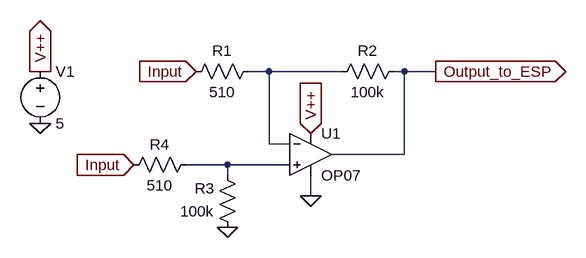
[diagram p0: schematic Amplifier.asc]
Amplifier.asc, the LTspice schematic file:
Version 4
SHEET 1 880 680
WIRE 352 112 320 112
WIRE 464 112 352 112
WIRE 560 112 544 112
WIRE 608 112 560 112
WIRE 352 224 352 112
WIRE 384 224 352 224
WIRE 560 240 560 112
WIRE 560 240 448 240
WIRE 288 256 224 256
WIRE 384 256 288 256
WIRE 288 272 288 256
WIRE 416 304 416 272
FLAG 0 112 V++
IOPIN 0 112 Out
FLAG 0 192 0
FLAG 416 208 V++
IOPIN 416 208 In
FLAG 608 112 Output_to_ESP
IOPIN 608 112 Out
FLAG 288 352 0
FLAG 144 256 Input
IOPIN 144 256 In
FLAG 240 112 Input
IOPIN 240 112 In
FLAG 416 304 0
SYMBOL voltage 0 96 R0
SYMATTR InstName V1
SYMATTR Value 5
SYMBOL OpAmps\\OP07 416 176 R0
SYMATTR InstName U1
SYMBOL res 336 96 R90
WINDOW 0 0 56 VBottom 2
WINDOW 3 32 56 VTop 2
SYMATTR InstName R1
SYMATTR Value 510
SYMBOL res 560 96 R90
WINDOW 0 0 56 VBottom 2
WINDOW 3 32 56 VTop 2
SYMATTR InstName R2
SYMATTR Value 100k
SYMBOL res 304 368 R180
WINDOW 0 36 76 Left 2
WINDOW 3 36 40 Left 2
SYMATTR InstName R3
SYMATTR Value 100k
SYMBOL res 128 272 R270
WINDOW 0 32 56 VTop 2
WINDOW 3 0 56 VBottom 2
SYMATTR InstName R4
SYMATTR Value 510

The netlist it stands for:
* Amplifier.asc
V1 V++ 0 5
XU1 N002 N001 V++ 0 Output_to_ESP LT1001  ; OP07, pins In+ In- V+ V- OUT
R1 N001 Input 510
R2 Output_to_ESP N001 100k
R3 0 N002 100k
R4 Input N002 510
.lib LTC.lib
.backanno
.end